# EAGLE design SwitchesStepAtten (EAGLE 9.3.1)
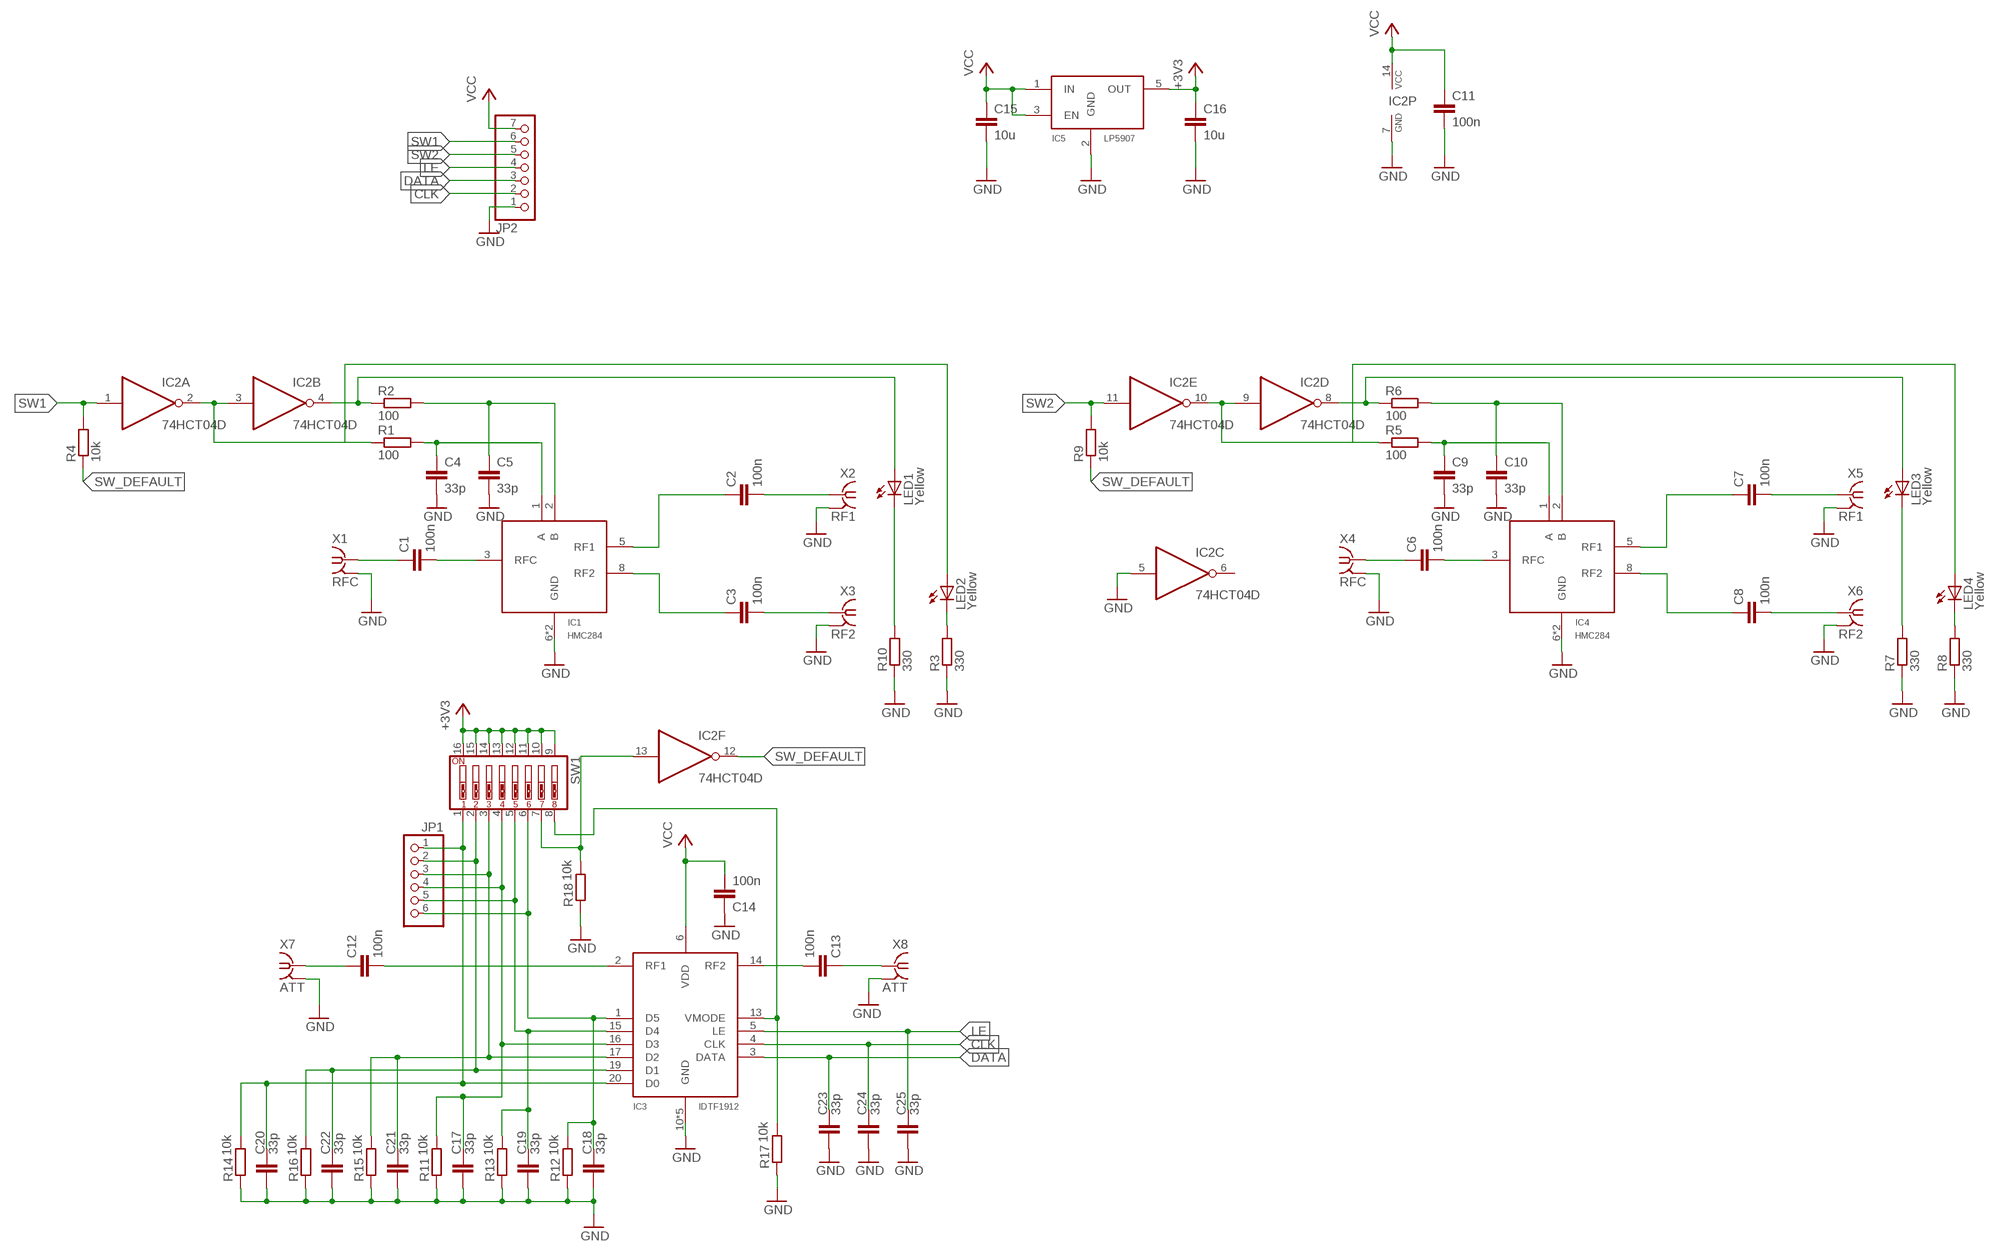
[diagram p0: schematic, sheet 1]

## Parts
C1  100n  C-EUC0603  [C0603]
C2  100n  C-EUC0603  [C0603]
C3  100n  C-EUC0603  [C0603]
C4  33p  C-EUC0603  [C0603]
C5  33p  C-EUC0603  [C0603]
C6  100n  C-EUC0603  [C0603]
C7  100n  C-EUC0603  [C0603]
C8  100n  C-EUC0603  [C0603]
C9  33p  C-EUC0603  [C0603]
C10  33p  C-EUC0603  [C0603]
C11  100n  C-EUC0603  [C0603]
C12  100n  C-EUC0603  [C0603]
C13  100n  C-EUC0603  [C0603]
C14  100n  C-EUC0603  [C0603]
C15  10u  C-EUC1206K  [C1206K]
C16  10u  C-EUC1206K  [C1206K]
C17  33p  C-EUC0603  [C0603]
C18  33p  C-EUC0603  [C0603]
C19  33p  C-EUC0603  [C0603]
C20  33p  C-EUC0603  [C0603]
C21  33p  C-EUC0603  [C0603]
C22  33p  C-EUC0603  [C0603]
C23  33p  C-EUC0603  [C0603]
C24  33p  C-EUC0603  [C0603]
C25  33p  C-EUC0603  [C0603]
IC1  HMC284  [MSOP08]
IC2  74HCT04D  [SO14]
IC3  IDTF1912  [QFN50P400X400X75-21T206]
IC4  HMC284  [MSOP08]
IC5  LP5907  [SOT23-5L]
JP1  PINHD-1X6  [1X06]
JP2  PINHD-1X7/90  [1X07/90]
LED1  Yellow  LED_ESML0603  [LED_SML0603]
LED2  Yellow  LED_ESML0603  [LED_SML0603]
LED3  Yellow  LED_ESML0603  [LED_SML0603]
LED4  Yellow  LED_ESML0603  [LED_SML0603]
R1  100  R-EU_R0603  [R0603]
R2  100  R-EU_R0603  [R0603]
R3  330  R-EU_R0603  [R0603]
R4  10k  R-EU_R0603  [R0603]
R5  100  R-EU_R0603  [R0603]
R6  100  R-EU_R0603  [R0603]
R7  330  R-EU_R0603  [R0603]
R8  330  R-EU_R0603  [R0603]
R9  10k  R-EU_R0603  [R0603]
R10  330  R-EU_R0603  [R0603]
R11  10k  R-EU_R0603  [R0603]
R12  10k  R-EU_R0603  [R0603]
R13  10k  R-EU_R0603  [R0603]
R14  10k  R-EU_R0603  [R0603]
R15  10k  R-EU_R0603  [R0603]
R16  10k  R-EU_R0603  [R0603]
R17  10k  R-EU_R0603  [R0603]
R18  10k  R-EU_R0603  [R0603]
SW1  SW_DIP-8  [EDG-08]
X1  RFC  SMA_CONNECTOR  [J502-ND-142-0711-821/826]
X2  RF1  SMA_CONNECTOR  [J502-ND-142-0711-821/826]
X3  RF2  SMA_CONNECTOR  [J502-ND-142-0711-821/826]
X4  RFC  SMA_CONNECTOR  [J502-ND-142-0711-821/826]
X5  RF1  SMA_CONNECTOR  [J502-ND-142-0711-821/826]
X6  RF2  SMA_CONNECTOR  [J502-ND-142-0711-821/826]
X7  ATT  SMA_CONNECTOR  [J502-ND-142-0711-821/826]
X8  ATT  SMA_CONNECTOR  [J502-ND-142-0711-821/826]

## Nets
+3V3: C16.1 IC5.5(OUT) SW1.9 SW1.10 SW1.11 SW1.12 SW1.13 SW1.14 SW1.15 SW1.16
CLK: C24.1 IC3.4(CLK) JP2.2
DATA: C23.1 IC3.3(DATA) JP2.3
GND: C4.2 C5.2 C9.2 C10.2 C11.2 C14.1 C15.2 C16.2 C17.2 C18.2 C19.2 C20.2 C21.2 C22.2 C23.2 C24.2 C25.2 IC1.6(GND) IC1.7(GND) IC2.5(C:I) IC2.7(P:GND) IC3.10(GND) IC3.11(GND) IC3.12(GND) IC3.18(GND) IC3.21(GND) IC4.6(GND) IC4.7(GND) IC5.2(GND) JP2.1 R3.1 R7.1 R8.1 R10.1 R11.1 R12.1 R13.1 R14.1 R15.1 R16.1 R17.1 R18.1 X1.G@1 X1.G@2 X1.G@3 X1.G@4 X2.G@1 X2.G@2 X2.G@3 X2.G@4 X3.G@1 X3.G@2 X3.G@3 X3.G@4 X4.G@1 X4.G@2 X4.G@3 X4.G@4 X5.G@1 X5.G@2 X5.G@3 X5.G@4 X6.G@1 X6.G@2 X6.G@3 X6.G@4 X7.G@1 X7.G@2 X7.G@3 X7.G@4 X8.G@1 X8.G@2 X8.G@3 X8.G@4
LE: C25.1 IC3.5(LE) JP2.4
N$1: C5.1 IC1.2(B) R2.2
N$2: C4.1 IC1.1(A) R1.2
N$3: C1.1 X1.1
N$4: C1.2 IC1.3(RFC)
N$5: C2.1 IC1.5(RF1)
N$6: C2.2 X2.1
N$7: C3.1 IC1.8(RF2)
N$8: C3.2 X3.1
N$9: IC2.4(B:O) LED1.A R2.1
N$10: IC2.2(A:O) IC2.3(B:I) LED2.A R1.1
N$11: C10.1 IC4.2(B) R6.2
N$12: LED2.C R3.2
N$13: C9.1 IC4.1(A) R5.2
N$14: C6.1 X4.1
N$15: C6.2 IC4.3(RFC)
N$16: C7.1 IC4.5(RF1)
N$17: C7.2 X5.1
N$18: C8.1 IC4.8(RF2)
N$19: C8.2 X6.1
N$20: IC2.8(D:O) LED3.A R6.1
N$21: IC2.9(D:I) IC2.10(E:O) LED4.A R5.1
N$22: LED3.C R7.2
N$23: LED4.C R8.2
N$24: C12.1 X7.1
N$25: C12.2 IC3.2(RF1)
N$26: C13.1 X8.1
N$27: C13.2 IC3.14(RF2)
N$28: C20.1 IC3.20(D0) JP1.1 R14.2 SW1.1
N$29: LED1.C R10.2
N$30: C22.1 IC3.19(D1) JP1.2 R16.2 SW1.2
N$31: C21.1 IC3.17(D2) JP1.3 R15.2 SW1.3
N$32: IC2.13(F:I) R18.2 SW1.7
N$33: C19.1 IC3.15(D4) JP1.5 R13.2 SW1.5
N$34: IC3.13(VMODE) R17.2 SW1.8
N$36: C18.1 IC3.1(D5) JP1.6 R12.2 SW1.6
N$38: C17.1 IC3.16(D3) JP1.4 R11.2 SW1.4
SW1: IC2.1(A:I) JP2.6 R4.2
SW2: IC2.11(E:I) JP2.5 R9.2
SW_DEFAULT: IC2.12(F:O) R4.1 R9.1
VCC: C11.1 C14.2 C15.1 IC2.14(P:VCC) IC3.6(VDD) IC5.1(IN) IC5.3(EN) JP2.7
Unconnected: IC2.6(C:O)

## Library data of the parts
C1-C14 C17-C25 = rcl:C-EU: CAPACITOR, European symbol
C15 C16 = resistor:C-EU: CAPACITOR, European symbol
IC1 IC4 = rf:HMC284
IC2 = 74xx-eu:74*04: Hex INVERTER
IC3 = rf:IDTF1912
IC5 = custom-ic:LP5907
JP1 = pinhead:PINHD-1X6: PIN HEADER
JP2 = pinhead:PINHD-1X7: PIN HEADER
LED1-LED4 = eagle-ltspice:LED_E: LED Source: http://www.osram.convergy.de Source: www.luxeon.com Source: www.kingbright.com; SPICEMODEL: NONE; SPICEPREFIX: D; SPICETYPE: diode
R1 R2 R5 R6 = rcl:R-EU_: RESISTOR, European symbol
R3 R4 R7-R18 = resistor:R-EU_: RESISTOR, European symbol
SW1 = special:SW_DIP-8: DIP SWITCH
X1-X8 = rf:SMA_CONNECTOR

## Board
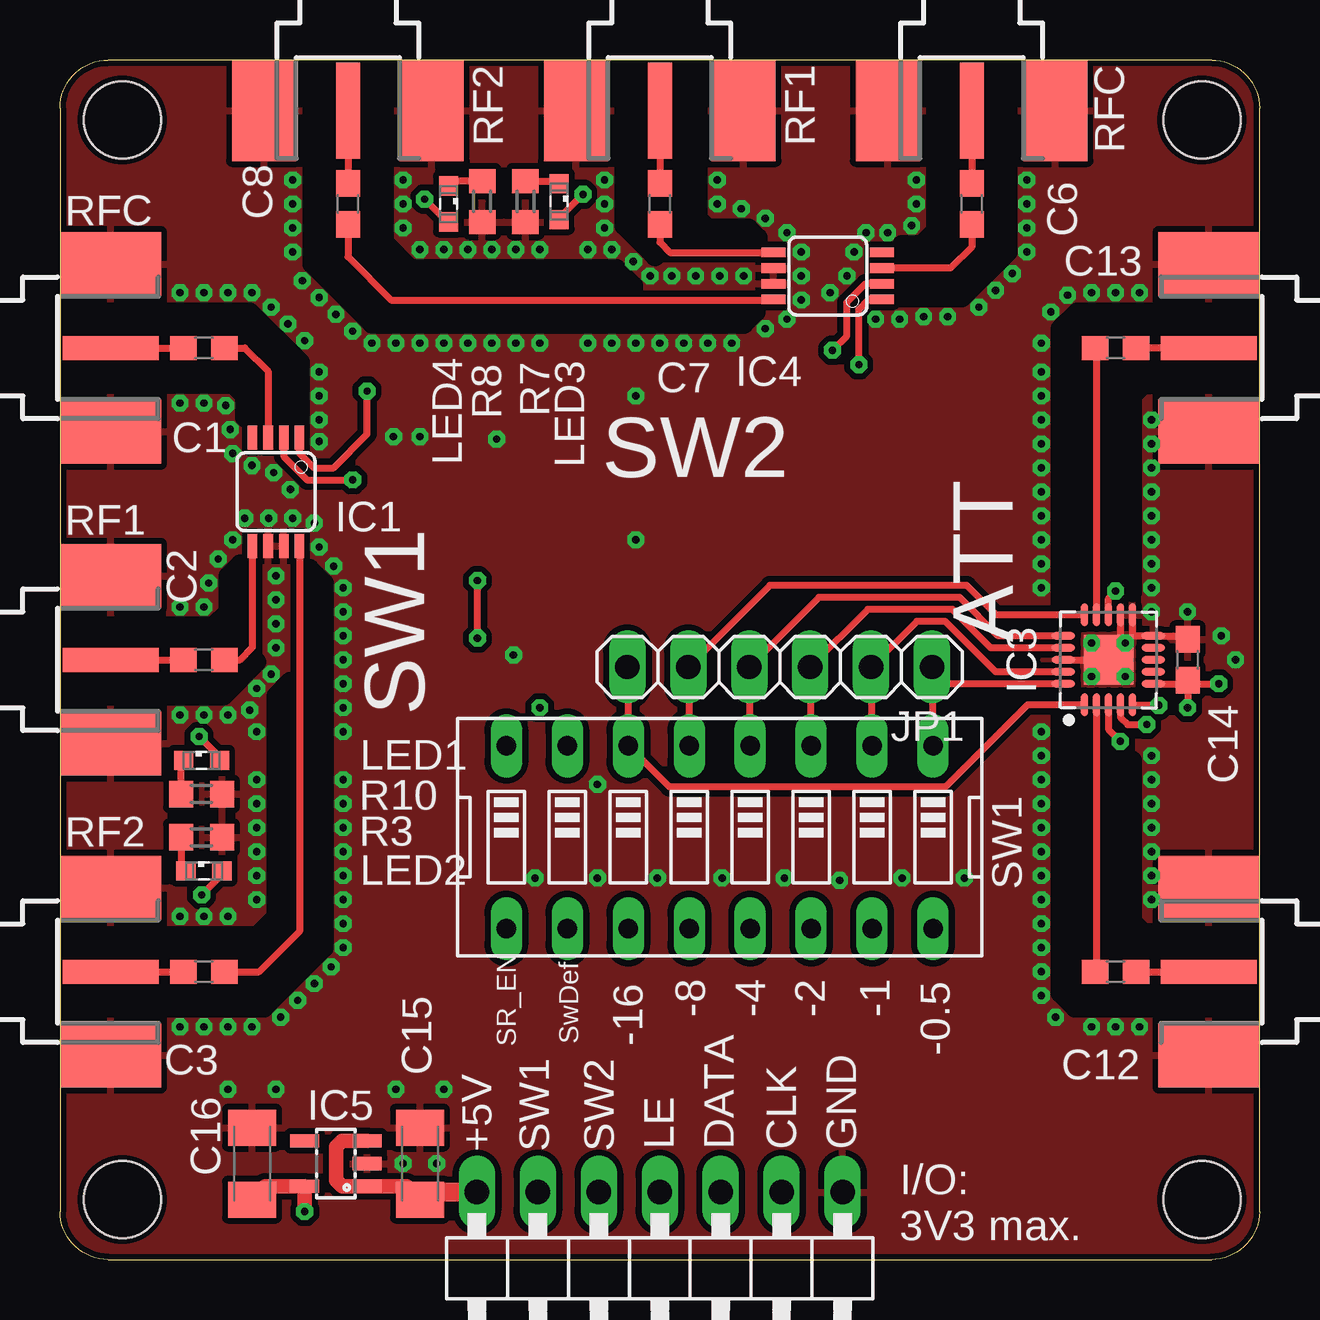
[diagram p1: board, top side]
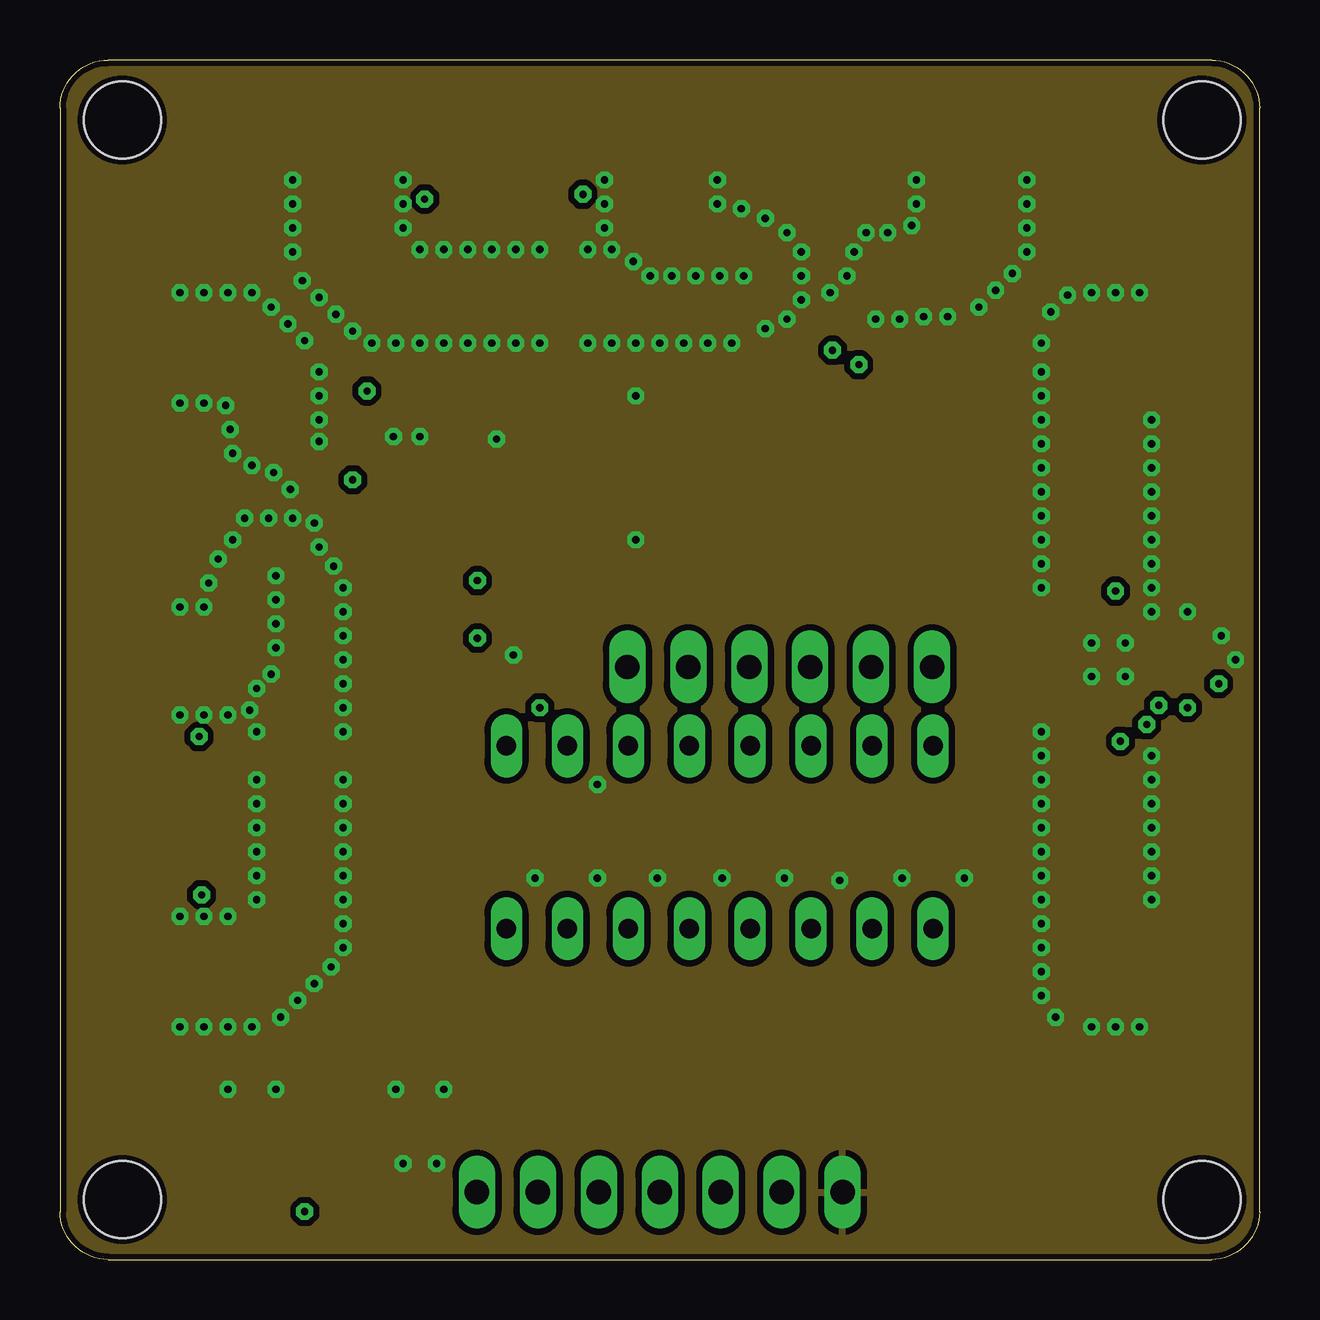
[diagram p2: board, inner layer Route2]
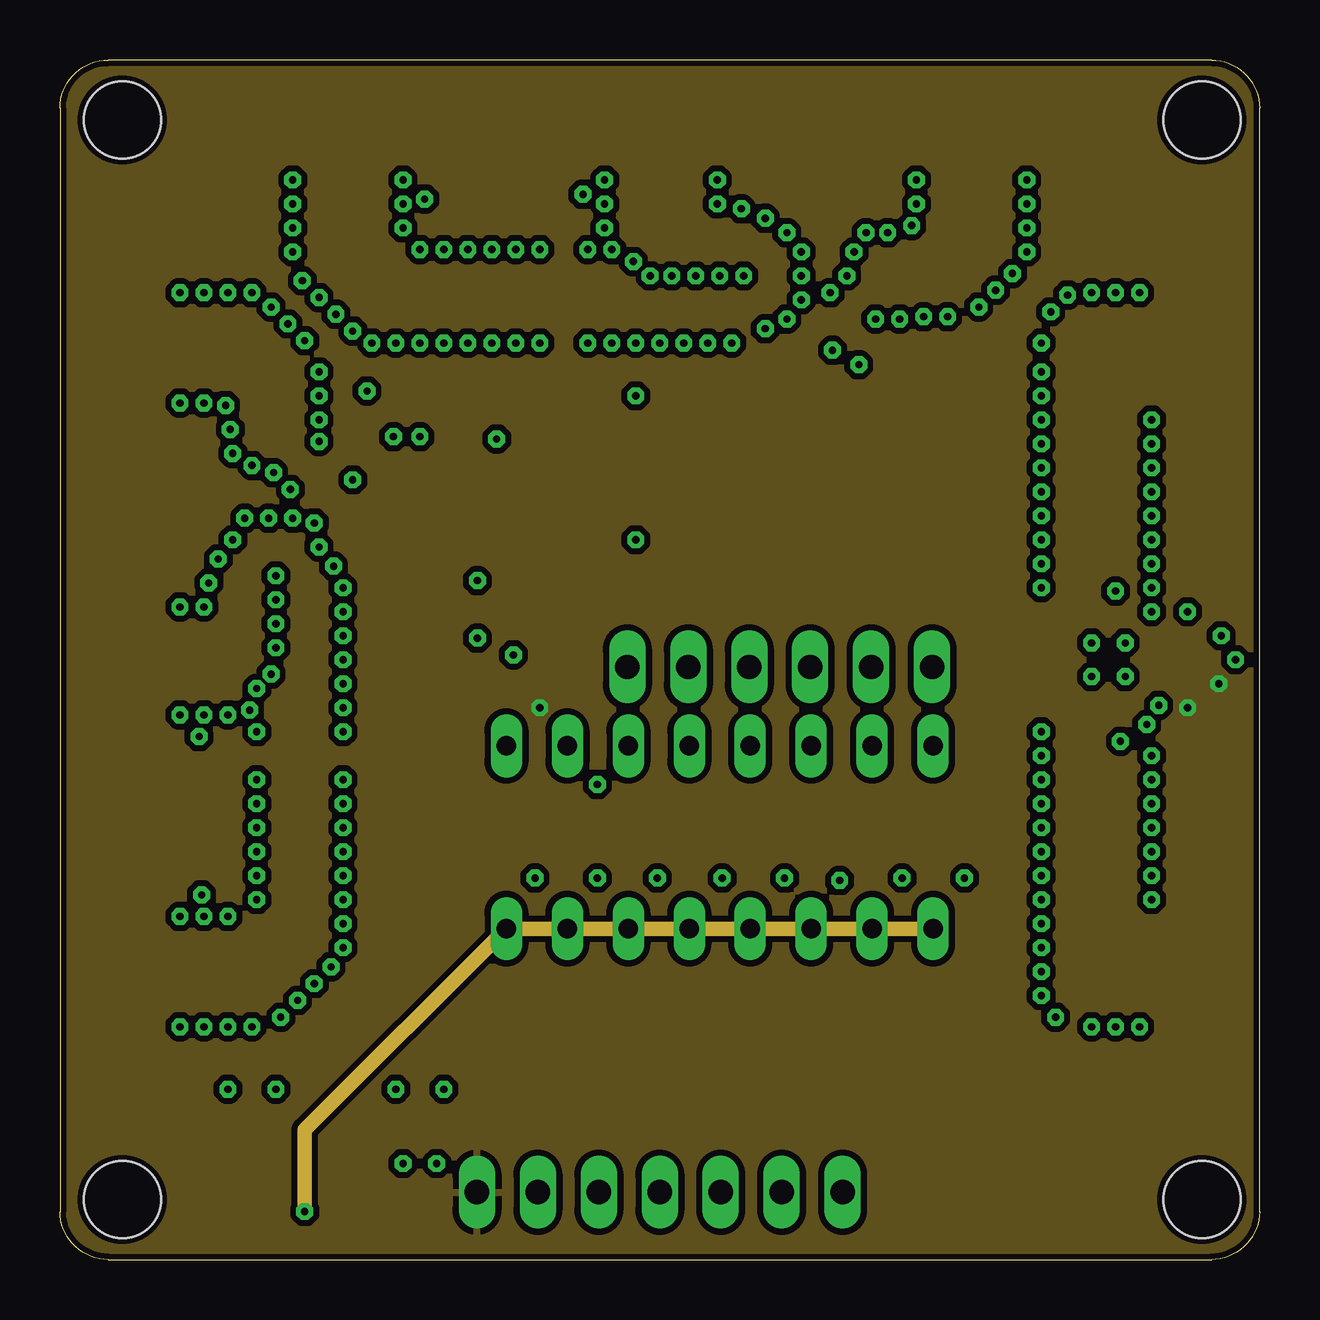
[diagram p3: board, inner layer Route15]
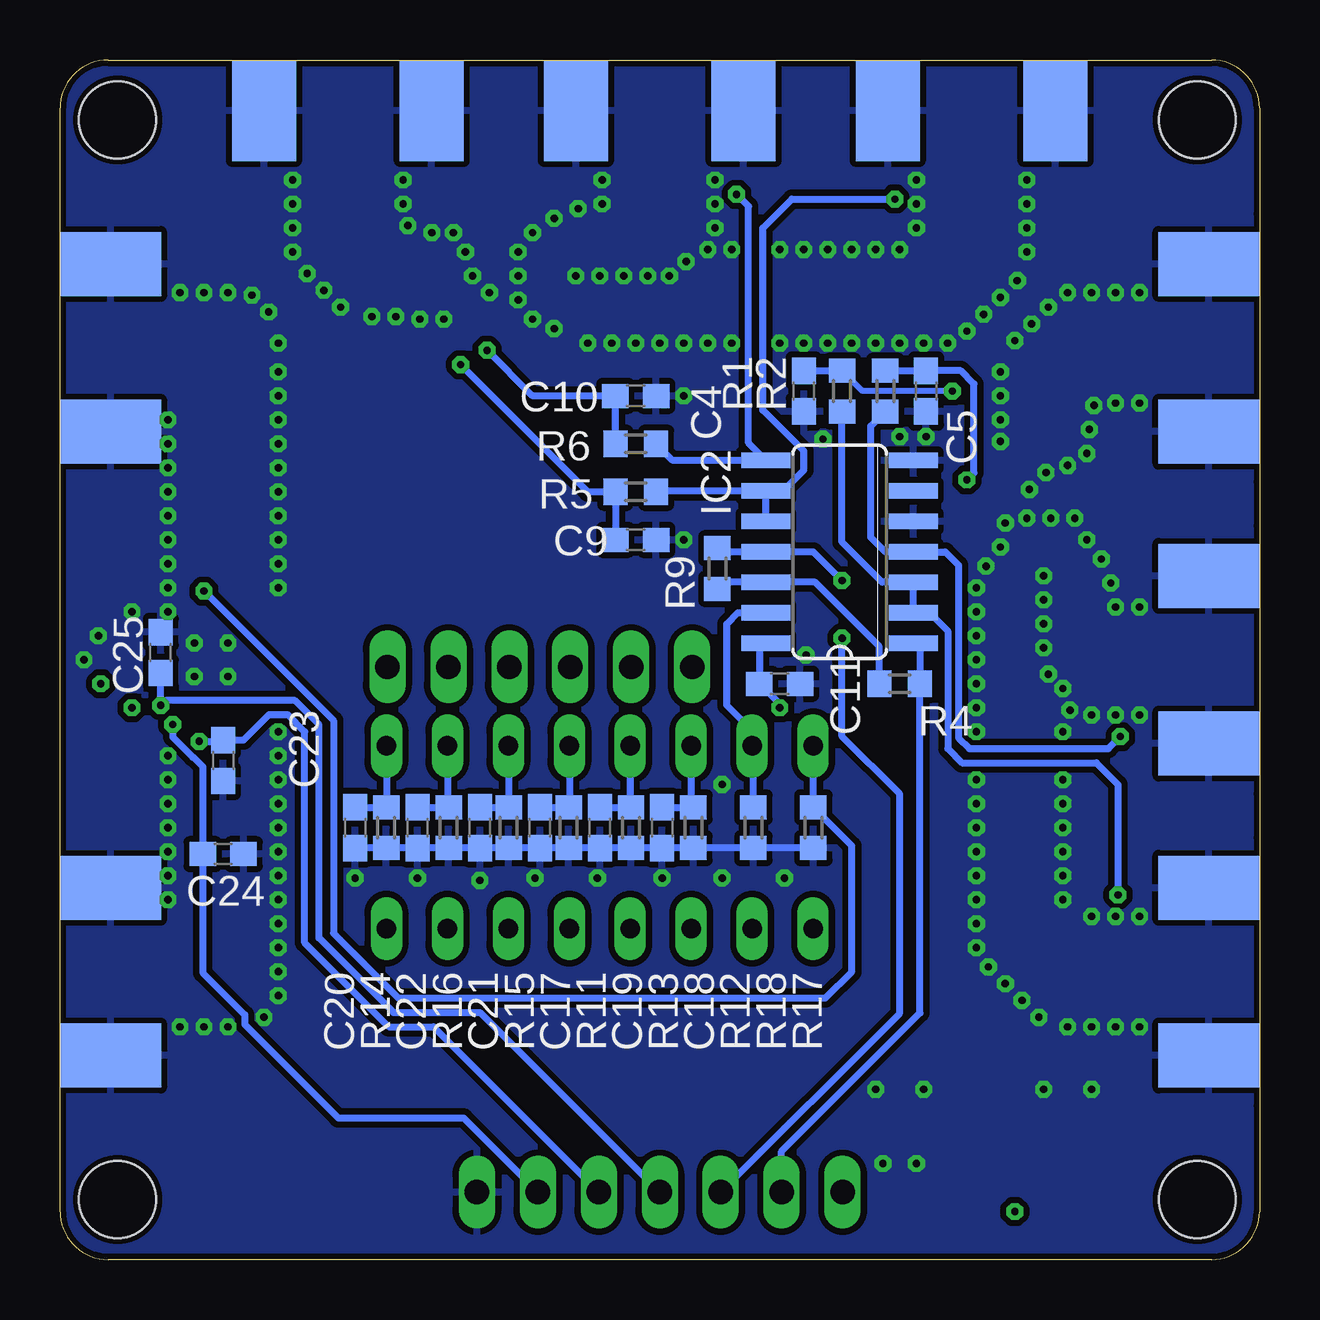
[diagram p4: board, bottom side, seen from below]

Size 50 x 50 mm. Coordinates in mm from the lower left corner, seen from the top.
Outline: 0,48 0,2 arc90 2,0 48,0 arc90 50,2 50,48 arc90 48,50 2,50 arc90 0,48
Copper layers (1+2*15+16): Top 0.035mm / dielectric 0.2mm / Route2 0.0175mm / dielectric 1.064mm / Route15 0.0175mm / dielectric 0.2mm / Bottom 0.035mm
Design rules "JLCPCB4L_7628 *": minimum track width 6mil, minimum drill 0.3mm, track to track 6mil, track to pad 6mil, pad to pad 6mil, via to via 6mil, smd to smd 0mil, copper to edge 0.2mm, drill to drill 0.2mm, minimum pad ring 10mil, minimum via ring 8mil, stop-mask expansion 4mil, vias tented up to drill 0mil, thermal gap 10mil
Holes 3.2 mm at 2.6,47.5 47.6,47.5 47.6,2.5 2.6,2.5
tRestrict: 52 lines

### Footprints (pad centres in the part's own frame; a part is rotated, then mirrored left to right if it is on the bottom)
C0603 = smd 1.1 x 1: 1 -0.85,0; 2 0.85,0
C1206K = smd 1.5 x 2: 1 -1.5,0; 2 1.5,0
MSOP08 = smd 0.4 x 1: 1 -0.976,-2.263; 2 -0.326,-2.263; 3 0.324,-2.263; 4 0.974,-2.263; 5 0.974,2.262; 6 0.324,2.262; 7 -0.326,2.262; 8 -0.976,2.262
SO14 = smd 0.66 x 2.032: 1 -3.81,-3.073; 2 -2.54,-3.073; 3 -1.27,-3.073; 4 0,-3.073; 5 1.27,-3.073; 6 2.54,-3.073; 7 3.81,-3.073; 8 3.81,3.073; 9 2.54,3.073; 10 1.27,3.073; 11 0,3.073; 12 -1.27,3.073; 13 -2.54,3.073; 14 -3.81,3.073
QFN50P400X400X75-21T206 = smd 0.962 x 0.282: 1 -1.875,1; 2 -1.875,0.5; 3 -1.875,0; 4 -1.875,-0.5; 5 -1.875,-1; 11 1.875,-1; 12 1.875,-0.5; 13 1.875,0; 14 1.875,0.5; 15 1.875,1 | smd 0.282 x 0.962: 6 -1,-1.875; 7 -0.5,-1.875; 8 0,-1.875; 9 0.5,-1.875; 10 1,-1.875; 16 1,1.875; 17 0.5,1.875; 18 0,1.875; 19 -0.5,1.875; 20 -1,1.875 | smd 2.06 x 2.06: 21 0,0
SOT23-5L = smd 0.55 x 1.2: 1 -0.95,-1.3; 2 0,-1.3; 3 0.95,-1.3; 4 0.95,1.3; 5 -0.95,1.3
1X06 = drill 1.016 long: 1 -6.35,0; 2 -3.81,0; 3 -1.27,0; 4 1.27,0; 5 3.81,0; 6 6.35,0
1X07/90 = drill 1.016 long: 1 -7.62,-3.81; 2 -5.08,-3.81; 3 -2.54,-3.81; 4 0,-3.81; 5 2.54,-3.81; 6 5.08,-3.81; 7 7.62,-3.81
LED_SML0603 = smd 0.8 x 0.8: A 0.75,0; C -0.75,0
R0603 = smd 1 x 1.1: 1 -0.85,0; 2 0.85,0
EDG-08 = drill 0.813 long: 1 -8.89,-3.81; 2 -6.35,-3.81; 3 -3.81,-3.81; 4 -1.27,-3.81; 5 1.27,-3.81; 6 3.81,-3.81; 7 6.35,-3.81; 8 8.89,-3.81; 9 8.89,3.81; 10 6.35,3.81; 11 3.81,3.81; 12 1.27,3.81; 13 -1.27,3.81; 14 -3.81,3.81; 15 -6.35,3.81; 16 -8.89,3.81
J502-ND-142-0711-821/826 = smd 4 x 1: 1 2.115,0 | smd 4.191 x 2.667: G@1 2.115,3.495; G@2 2.115,-3.495 | smd 4.191 x 2.667 bottom: G@3 2.115,3.495; G@4 2.115,-3.495

### Placement (x,y rotation side)
C1  6,38 0 top
C2  6,25 180 top
C3  6,12 180 top
C4  19,36.2 270 bottom
C5  13.9,36.2 270 bottom
C6  38,44 270 top
C7  25,44 90 top
C8  12,44 90 top
C9  26,30 0 bottom
C10  26,36 0 bottom
C11  20,24 0 bottom
C12  44,12 180 top
C13  44,38 180 top
C14  47,25 270 top
C15  15,4 90 top
C16  8,4 90 top
C17  30,18 270 bottom
C18  24.9,18 270 bottom
C19  27.5,18 270 bottom
C20  37.7,18 270 bottom
C21  32.5,18 270 bottom
C22  35.1,18 270 bottom
C23  43.2,20.8 270 bottom
C24  43.2,16.9 0 bottom
C25  45.8,25.3 90 bottom
IC1  9,32 180 top
IC2  17.5,29.5 90 bottom
IC3  43.7,25 90 top
IC4  32,41 90 top
IC5  11.5,4 90 top
JP1  30,24.7 180 top
JP2  25,-1 180 top
LED1  5.9,20.8 0 top
LED2  6,16.2 0 top
LED3  20.8,44.1 270 top
LED4  16.2,44 270 top
R1  17.4,36.2 90 bottom
R2  15.6,36.2 90 bottom
R3  5.9,17.6 180 top
R4  15,24 0 bottom
R5  26,32 180 bottom
R6  26,34 180 bottom
R7  19.4,44.1 90 top
R8  17.6,44.1 90 top
R9  22.6,28.8 90 bottom
R10  5.9,19.4 180 top
R11  28.8,18 90 bottom
R12  23.6,18 90 bottom
R13  26.2,18 90 bottom
R14  36.4,18 90 bottom
R15  31.3,18 90 bottom
R16  33.8,18 90 bottom
R17  18.6,18 90 bottom
R18  21.1,18 90 bottom
SW1  27.5,17.6 180 top
X1  0,38 0 top
X2  0,25 0 top
X3  0,12 0 top
X4  38,50 270 top
X5  25,50 270 top
X6  12,50 270 top
X7  50,12 180 top
X8  50,38 180 top

### Tracks (layer width: path | path; a pad name or v marks a point on that pad's centre or on a via)
+3V3  (via drill 0.3)
  Top 0.6: C16.1 8.55,3.05 IC5.5 v10.2,2
  Route15 0.6: v10.2,2 10.2,5.4 18.59,13.79 SW1.9 SW1.10 SW1.11 SW1.12 SW1.13 SW1.14 SW1.15 SW1.16
CLK  (via drill 0.3)
  Top 0.3: IC3.4 44.2,22.6 44.5,22.3 v45.3,22.3
  Bottom 0.3: JP2.2 33.17,5.9 38.4,5.9 42.3,9.8 42.3,10.2 44.05,11.95 C24.1 44.05,20.55 44.44,20.94 44.47,20.94 45.3,21.77 v45.3,22.3
DATA  (via drill 0.3)
  Top 0.3: IC3.3 43.7,22.1 v44.2,21.6
  Bottom 0.3: v44.2,21.6 43.25,21.6 C23.1 42.35,21.65 41.3,22.7 40.5,22.7 39.8,22 39.8,13.2 36.3,9.7 34.43,9.7 JP2.3
GND  (via drill 0.3)
  Top 0.3: C14.1 46.85,26 IC3.10 44.7,26 | IC3.18 IC3.21 | IC3.12 44.2,25.5 IC3.21 | IC3.11 44.7,26 | 44.7,26 IC3.21
  Bottom 0.3: R17.1 R18.1 R12.1 C18.2 R13.1 C19.2 R11.1 C17.2 R15.1 C21.2 R16.1 C22.2 R14.1 C20.2
  other vias: 40.3,45 40.3,44 40.3,43 40.3,42 39.7,41.1 39,40.4 38.3,39.7 37,39.3 36,39.3 35,39.2 34,39.2 35.7,45 35.7,44 35.5,43.1 34.5,42.8 33.6,42.8 33.1,42 32.8,41 32.1,40.3 27.4,45 27.4,44 28.4,43.8 29.4,43.4 30.3,42.8 30.9,42 30.9,41 30.9,40 30.3,39.2 29.4,38.8 28,38.2 27,38.2 26,38.2 25,38.2 24,38.2 23,38.2 22,38.2 20,38.2 19,38.2 18,38.2 17,38.2 16,38.2 15,38.2 14,38.2 13,38.2 12.2,38.7 11.5,39.4 10.8,40.1 10.1,40.8 9.7,42 9.7,43 9.7,44 9.7,45 14.3,45 14.3,44 14.3,43 15,42.1 16,42.1 17,42.1 18,42.1 19,42.1 20,42.1 22,42.1 23,42.1 23.9,41.6 24.6,41 28.5,41 27.5,41 26.5,41 25.5,41 22.7,45 22.7,44 22.7,43 5,40.3 6,40.3 7,40.3 8,40.3 8.8,39.7 9.5,39 10.2,38.3 10.8,37 10.8,36 10.8,35 10.8,34.1 5,35.7 6,35.7 6.9,35.6 7.1,34.6 7.2,33.6 8,33.1 8.9,32.8 9.6,32.1 5,27.2 6,27.2 6.2,28.2 6.6,29.2 7.2,30 7.7,30.9 8.7,30.9 9.7,30.9 10.6,30.7 10.8,29.7 11.4,28.9 11.8,28 11.8,27 11.8,26 11.8,25 11.8,24 11.8,23 11.8,22 11.8,20 11.8,19 11.8,18 11.8,17 11.8,16 11.8,15 11.8,14 11.8,13 11.3,12.2 10.6,11.5 9.9,10.8 9.2,10.1 8,9.7 7,9.7 6,9.7 5,9.7 5,14.3 6,14.3 7,14.3 8.2,15 8.2,16 8.2,17 8.2,18 8.2,19 8.2,20 8.2,22 7.9,22.9 5,22.7 6,22.7 7,22.7 9,28.5 9,27.5 9,26.5 9,25.5 8.8,24.4 8.2,23.8 45,40.3 44,40.3 43,40.3 42,40.2 41.3,39.5 40.9,38.2 40.9,37 40.9,36 40.9,35 40.9,34 40.9,33 40.9,32 40.9,31 40.9,30 40.9,29 40.9,28 45.5,35 45.5,34 45.5,33 45.5,32 45.5,31 45.5,30 45.5,29 45.5,28 45.5,27 43,25.7 44.4,25.7 44.4,24.3 43,24.3 40.9,22 40.9,21 40.9,20 40.9,19 40.9,18 40.9,17 40.9,16 40.9,15 40.9,14 40.9,13 40.9,12 40.9,11 41.5,10.1 43,9.7 44,9.7 45,9.7 45.5,15 45.5,16 45.5,17 45.5,18 45.5,19 45.5,20 45.5,21 47,27 48.4,26 49,25 18.9,25.2 24,36 24,30 18.2,34.2 13.9,34.3 15,34.3 37.7,15.9 35.1,15.9 32.5,15.8 30.2,15.9 27.6,15.9 24.9,15.9 22.4,15.9 19.8,15.9 22.4,19.8 7,7.1 9,7.1 14,7.1 16,7.1 14.3,4 15.7,4
  pour Route2 (isolate 0.254): -2.8,52.7 53.5,52.7 53.5,-1.9 -2.8,-1.9
  pour Bottom (isolate 0.254): -1.6,51.6 52.1,51.6 52.1,-0.7 -1.6,-0.7
  pour Top (isolate 0.254): -3.4,53.1 54.5,53.1 54.5,-2.8 -3.4,-2.8
LE  (via drill 0.3)
  Top 0.3: IC3.5 45.77,23.12 v45.8,23.1
  Bottom 0.3: C25.1 v45.8,23.1 45.6,23.3 40.2,23.3 39.2,22.3 39.2,13.4 36.1,10.3 32.49,10.3 JP2.4
N$1  (via drill 0.3)
  Top 0.3: IC1.2 9.33,33.47 10.3,32.5 v12.2,32.5
  Bottom 0.3: R2.2 C5.1 12.45,37.05 11.9,36.5 11.9,32.8 v12.2,32.5
N$2  (via drill 0.3)
  Top 0.3: IC1.1 9.98,33.62 10.6,33 11.4,33 12.8,34.4 v12.8,36.2
  Bottom 0.25: v12.8,36.2 16.55,36.2 R1.2
  Bottom 0.3: C4.1 R1.2
N$3
  Top 0.3: X1.1 C1.1
N$4
  Top 0.3: C1.2 7.7,38 8.68,37.02 IC1.3
N$5
  Top 0.3: C2.1 7.5,25 8.03,25.53 IC1.5
N$6
  Top 0.3: X2.1 C2.2
N$7
  Top 0.3: C3.1 8.3,12 10,13.7 10,29.71 IC1.8
N$8
  Top 0.3: X3.1 C3.2
N$9  (via drill 0.3)
  Top 0.3: v5.8,21.8 6.65,20.95 LED1.A
  Bottom 0.3: R2.1 16.2,34.75 16.2,30.1 15.6,29.5 IC2.4 13.1,29.5 12.55,28.95 12.55,21.75 12.1,21.3 6.3,21.3 v5.8,21.8
N$10  (via drill 0.3)
  Top 0.3: v5.9,15.2 6.75,16.05 LED2.A
  Bottom 0.3: R1.1 17.4,29.9 15.73,28.23 IC2.3 IC2.2 13.76,26.96 13,26.2 13,21.3 12.4,20.7 6.8,20.7 5.9,19.8 v5.9,15.2
N$11  (via drill 0.3)
  Top 0.3: IC4.2 33.57,40.67 32.8,39.9 32.8,38.5 v32.2,37.9
  Bottom 0.3: R6.2 C10.1 30.3,36 v32.2,37.9
N$12
  Top 0.3: R3.2 5.05,16.2 LED2.C
N$13  (via drill 0.3)
  Top 0.3: IC4.1 33.72,40.02 33.3,39.6 v33.3,37.3
  Bottom 0.3: C9.1 R5.2 28,32 v33.3,37.3
N$14
  Top 0.3: X4.1 C6.1
N$15
  Top 0.3: C6.2 38,42.2 37.12,41.32 IC4.3
N$16
  Top 0.3: C7.1 25,42.4 25.43,41.97 IC4.5
N$17
  Top 0.3: X5.1 C7.2
N$18
  Top 0.3: C8.1 12,41.8 13.8,40 29.71,40 IC4.8
N$19
  Top 0.3: X6.1 C8.2
N$20  (via drill 0.3)
  Top 0.3: v21.8,44.4 20.8,43.4 LED3.A
  Bottom 0.3: R6.1 24.46,33.31 IC2.8 21.3,34.04 21.3,43.9 v21.8,44.4
N$21  (via drill 0.3)
  Top 0.3: v15.2,44.2 16.15,43.25 LED4.A
  Bottom 0.3: IC2.10 IC2.9 | IC2.9 25.11,32.04 R5.1 | IC2.9 19.86,32.04 19,32.9 19,33.7 20.7,35.4 20.7,43 19.5,44.2 v15.2,44.2
N$22
  Top 0.3: R7.2 20.8,44.95 LED3.C
N$23
  Top 0.3: R8.2 16.2,44.95 LED4.C
N$24
  Top 0.3: C12.1 X7.1
N$25
  Top 0.3: IC3.2 43.2,12.05 C12.2
N$26
  Top 0.3: X8.1 C13.1
N$27
  Top 0.3: C13.2 43.2,37.95 IC3.14
N$28
  Top 0.3: IC3.20 37.05,24 JP1.1 36.39,24.66 SW1.1
  Bottom 0.3: C20.1 R14.2 SW1.1
N$29
  Top 0.3: R10.2 5.05,20.8 LED1.C
N$30
  Top 0.3: SW1.2 33.85,24.66 JP1.2 35.71,26.6 36.9,26.6 39,24.5 IC3.19
  Bottom 0.3: C22.1 R16.2 33.85,18.9 SW1.2
N$31
  Top 0.3: SW1.3 31.31,24.66 JP1.3 33.67,27.1 37.2,27.1 38.8,25.5 IC3.17
  Bottom 0.3: C21.1 R15.2 SW1.3
N$32
  Bottom 0.3: R18.2 21.1,21.36 SW1.7 21.15,22.05 22.2,23.1 22.2,26.5 21.74,26.96 IC2.13
N$33
  Top 0.3: SW1.5 26.23,24.66 JP1.5 29.59,28.1 37.8,28.1 39.02,26.88 IC3.15
  Bottom 0.3: C19.1 26.4,18.85 | 26.4,18.85 R13.2 | SW1.5 26.23,19.02 26.4,18.85
N$34  (via drill 0.3)
  Top 0.3: IC3.13 43.7,27.56 v44,27.86
  Bottom 0.3: SW1.8 R17.2 17,17.25 17,12 18.1,10.9 35.9,10.9 38.6,13.6 38.6,22.46 v44,27.86
N$36
  Top 0.3: JP1.6 23.69,24.66 SW1.6 25.4,19.7 36.9,19.7 40.33,23.12 IC3.1
  Bottom 0.3: C18.1 23.7,18.85 | 23.7,18.85 R12.2 | SW1.6 23.69,18.86 23.7,18.85
N$38
  Top 0.3: SW1.4 28.77,24.66 JP1.4 31.63,27.6 37.5,27.6 39.1,26 IC3.16
  Bottom 0.3: C17.1 R11.2 28.77,18.88 SW1.4
SW1
  Bottom 0.3: IC2.1 14.15,25.41 R4.2 14.15,10.28 19.92,4.51 JP2.6
SW2  (via drill 0.3)
  Top 0.3: v17.4,25.9 v17.4,28.3
  Bottom 0.3: R9.2 22.45,29.5 IC2.11 18.6,29.5 v17.4,28.3 | JP2.5 15,10.27 15,19.4 17.4,21.8 v17.4,25.9
SW_DEFAULT
  Bottom 0.3: R9.1 22.32,28.23 IC2.12 18.53,28.23 15.85,25.55 R4.1
VCC  (via drill 0.3)
  Top 0.3: IC3.6 46.85,24 C14.2 | C14.2 47.15,24 v48.3,24 | C14.2 v47,23
  Top 0.6: C15.1 14.45,3.05 IC5.1 11.75,3.05 11.5,3.3 11.5,4.7 11.75,4.95 IC5.3
  Top 0.8: JP2.7 15.31,2.81 C15.1
  Bottom 0.3: IC2.14 20.85,25.41 C11.1 20,23.15 v20,23
  pour Route15 (isolate 0.254): -2.2,52.2 52.8,52.2 52.8,-1.4 -2.2,-1.4

### Text on the board
tPlace: RF2 | RF1 | RFC | RFC | SW2 | ATT | RF1 | SW1 | RF2 | -8 | -4 | -2 | -1 | SR_EN | SwDef | -16 | -0.5 | LE | DATA | CLK | GND | +5V | SW1 | SW2 | I/O: / 3V3 max.